# Altium schematic sheet HW.SchDoc
size A3; SheetNumber: 4; SheetTotal: 6
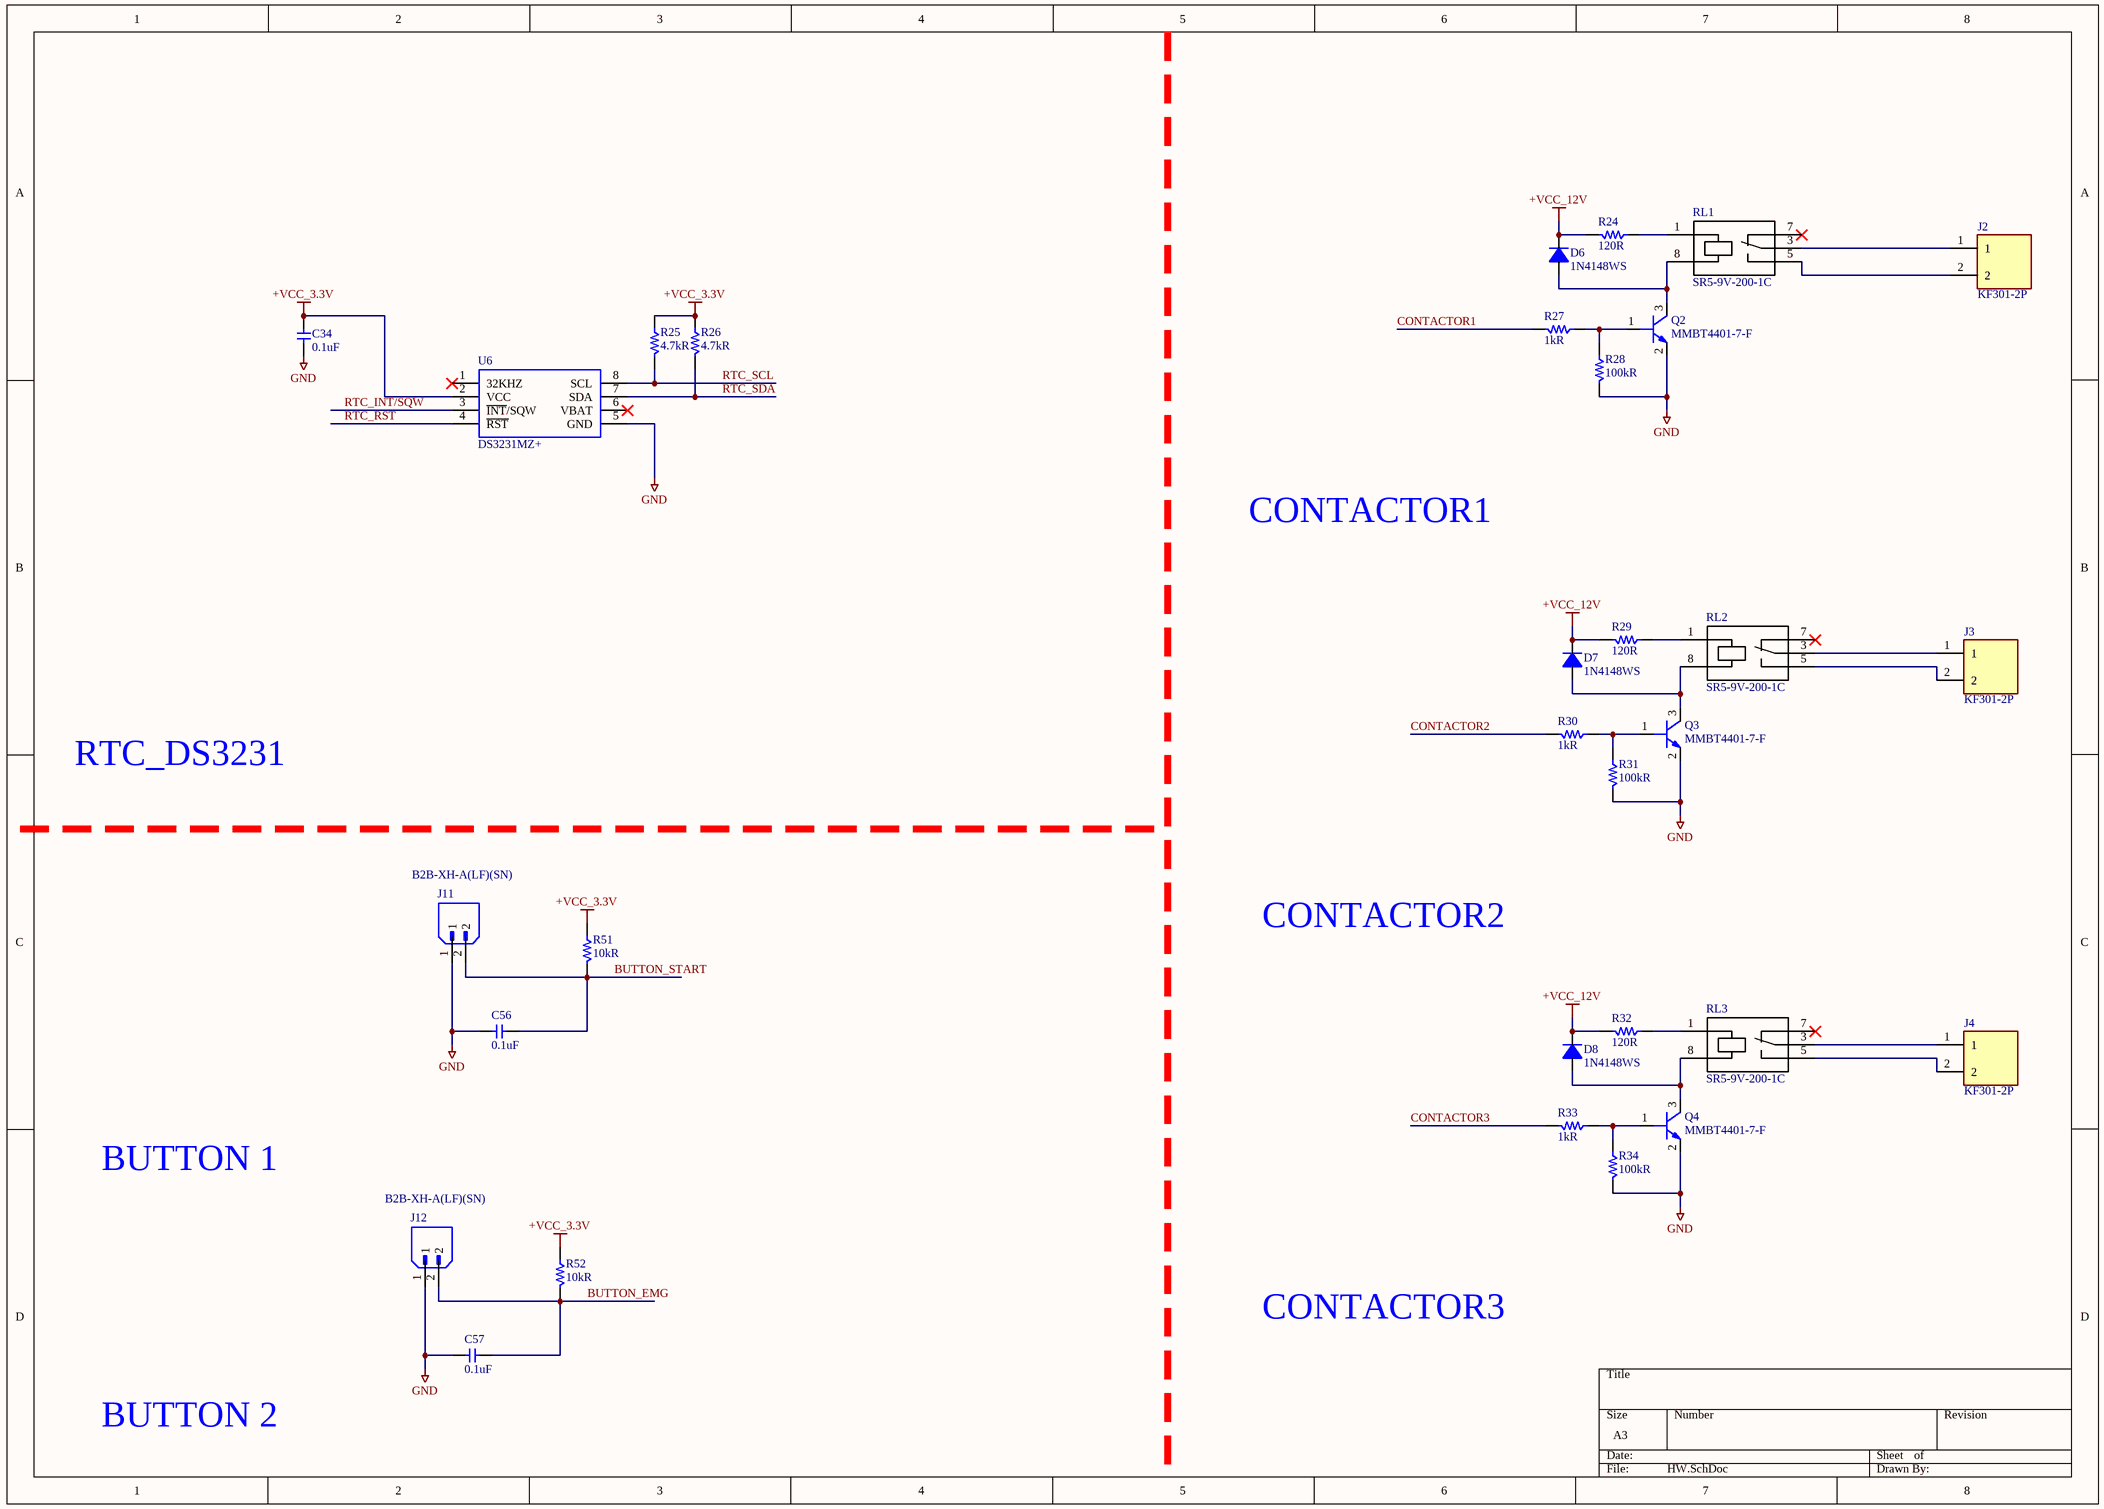
[diagram p0: HW.SchDoc]

## Parts
C34  0.1uF  [CAP 0402 (1005)]
C56  0.1uF  [CAP 0402 (1005)]
C57  0.1uF  [CAP 0402 (1005)]
D6  1N4148WS  [SOD323]
D7  1N4148WS  [SOD323]
D8  1N4148WS  [SOD323]
J2  KF301-2P  [HANDSON_KF301-2P]
J3  KF301-2P  [HANDSON_KF301-2P]
J4  KF301-2P  [HANDSON_KF301-2P]
J11  B2B-XH-A(LF)(SN)  [JST_B2B-XH-A(LF)(SN)]
J12  B2B-XH-A(LF)(SN)  [JST_B2B-XH-A(LF)(SN)]
Q2  MMBT4401-7-F  [SOT-23-3]
Q3  MMBT4401-7-F  [SOT-23-3]
Q4  MMBT4401-7-F  [SOT-23-3]
R24  120R  [RES 0603 (1608)]
R25  4.7kR  [RES 0402 (1005)]
R26  4.7kR  [RES 0402 (1005)]
R27  1kR  [RES 0402 (1005)]
R28  100kR  [RES 0402 (1005)]
R29  120R  [RES 0603 (1608)]
R30  1kR  [RES 0402 (1005)]
R31  100kR  [RES 0402 (1005)]
R32  120R  [RES 0603 (1608)]
R33  1kR  [RES 0402 (1005)]
R34  100kR  [RES 0402 (1005)]
R51  10kR  [RES 0402 (1005)]
R52  10kR  [RES 0402 (1005)]
RL1  SR5-9V-200-1C  [RELAY SR5-9V-200-1C]
RL2  SR5-9V-200-1C  [RELAY SR5-9V-200-1C]
RL3  SR5-9V-200-1C  [RELAY SR5-9V-200-1C]
U6  DS3231MZ+  [SOIC127P600X175-8N]

## Nets
+VCC_3.3V: C34.1 R25.2 R26.2 R51.2 R52.2 U6.2(VCC)
+VCC_12V: D6.1(K) D7.1(K) D8.1(K) R24.1 R29.1 R32.1
GND: C34.2 C56.2 C57.2 J11.1 J12.1 Q2.2(E) Q3.2(E) Q4.2(E) R28.1 R31.1 R34.1 U6.5(GND)
BUTTON_EMG: C57.1 J12.2 R52.1
BUTTON_START: C56.1 J11.2 R51.1
CONTACTOR1: R27.1
CONTACTOR2: R30.1
CONTACTOR3: R33.1
RTC_INT/SQW: U6.3(~{INT}/SQW)
RTC_RST: U6.4(~{RST})
RTC_SCL: R25.1 U6.8(SCL)
RTC_SDA: R26.1 U6.7(SDA)
NetD6_2: D6.2(A) Q2.3(C) RL1.8(C2)
NetD7_2: D7.2(A) Q3.3(C) RL2.8(C2)
NetD8_2: D8.2(A) Q4.3(C) RL3.8(C2)
NetJ2_1: J2.1 RL1.3(C)
NetJ2_2: J2.2 RL1.5(NO)
NetJ3_1: J3.1 RL2.3(C)
NetJ3_2: J3.2 RL2.5(NO)
NetJ4_1: J4.1 RL3.3(C)
NetJ4_2: J4.2 RL3.5(NO)
NetQ2_1: Q2.1(B) R27.2 R28.2
NetQ3_1: Q3.1(B) R30.2 R31.2
NetQ4_1: Q4.1(B) R33.2 R34.2
NetR24_2: R24.2 RL1.1(C1)
NetR29_2: R29.2 RL2.1(C1)
NetR32_2: R32.2 RL3.1(C1)

Not connected (* = marked no-connect by the designer): RL1 7(NC)*; RL2 7(NC)*; RL3 7(NC)*; U6 1(32KHZ)* 6(VBAT)*

## Notes on the sheet
- CONTACTOR1
- RTC_DS3231
- CONTACTOR2
- BUTTON 1
- CONTACTOR3
- BUTTON 2

## Library data of the parts
C34 C56 C57 = CAP0402 0.1uF 50V: 50V 100nF ±10% 0402 Multilayer Ceramic Capacitors MLCC - SMD/SMT ROHS; Manufacturer: Samwha Capacitor; Manufacturer Part Number: CS1005X7R104K500NR; Supplier: LCSC electronics; Unit Price: $0.0017
D6-D8 = DIO 1N4148WS: DIODE GEN PURP 75V 150MA SOD323F; Manufacturer: Fairchild/ON Semiconductor; Diode Type: Standard; Voltage - Forward (Vf) (Max) @ If: 1V @ 10mA; Speed: Small Signal =< 200mA (Io), Any Speed; Current - Reverse Leakage @ Vr: 5µA @ 75V; Capacitance @ Vr, F: 4pF @ 0V, 1MHz; Supplier 1: Digi-Key; Manufacturer Part Number: 1N4148WS; RoHS: RoHS Compliant; Category: Discrete Semiconductor Products; Stock 1: 318953; Pricing 1: 1=0.18, 10=0.168, 100=0.0912, 500=0.05614, 1000=0.03827 (USD); Packaging: Cut Tape (CT); Part Status: Active; Current - Average Rectified (Io): 150mA; Mounting Type: Surface Mount; Package / Case: SC-90, SOD-323F; Supplier Device Package: SOD-323F; Operating Temperature - Junction: 150°C (Max); ComponentLink1URL: https://www.fairchildsemi.com/datasheets/1N/1N4148WS.pdf; ComponentLink1Description: https://www.fairchildsemi.com/datasheets/1N/1N4148WS.pdf; Supplier Part Number 1: 1N4148WSFSCT-ND
J2-J4 = KF301-2P: 2 Pin Terminal Block 5mm Pitch; MF: Handson Technology; SnapEDA_Link: https://www.snapeda.com/parts/KF301-2P/Handson+Technology/view-part/?ref=snap; Package: None; Value: *; MP: KF301-2P; Check_prices: https://www.snapeda.com/parts/KF301-2P/Handson+Technology/view-part/?ref=eda
J11 J12 = B2B-XH-A(LF)(SN): Connector Header Through Hole 2 position 0.098 (2.50mm); MF: JST Sales; SnapEDA_Link: https://www.snapeda.com/parts/B2B-XH-A(LF)(SN)/JST/view-part/?ref=snap; Package: None; Value: *; MP: B2B-XH-A(LF)(SN); Check_prices: https://www.snapeda.com/parts/B2B-XH-A(LF)(SN)/JST/view-part/?ref=eda
Q2-Q4 = TRANS MMBT4401-7-F: TRANS NPN 40V 0.6A SMD SOT23-3; Manufacturer: Diodes Incorporated; Vce Saturation (Max) @ Ib, Ic: 750mV @ 50mA, 500mA; DC Current Gain (hFE) (Min) @ Ic, Vce: 100 @ 150mA, 1V; Frequency - Transition: 250MHz; Supplier 1: Digi-Key; Manufacturer Part Number: MMBT4401-7-F; RoHS: RoHS Compliant; Category: Discrete Semiconductor Products; Stock 1: 86548; Pricing 1: 1=0.15, 10=0.134, 100=0.0729, 500=0.04486, 1000=0.03059 (USD); Packaging: Cut Tape (CT); Part Status: Active; Transistor Type: NPN; Current - Collector Cutoff (Max): -; Operating Temperature: -55°C ~ 150°C (TJ); Mounting Type: Surface Mount; Package / Case: TO-236-3, SC-59, SOT-23-3; Supplier Device Package: SOT-23-3; ComponentLink1URL: https://www.diodes.com/assets/Datasheets/ds30039.pdf; ComponentLink1Description: https://www.diodes.com/assets/Datasheets/ds30039.pdf; Supplier Part Number 1: MMBT4401-FDICT-ND
R24 R29 R32 = RES0603 120R 1%: ±1% 120Ω 0603 Chip Resistor - Surface Mount ROHS; Manufacturer: VO; Manufacturer Part Number: SCR0603F120R; Supplier: LCSC electronics; Unit Price: $0.0009
R25 R26 = RES0402 4.7kR 1%: ±1% 4.7kΩ 0402 Chip Resistor - Surface Mount ROHS; Manufacturer: VO; Manufacturer Part Number: SCR0402F4K7; Supplier: LCSC electronics; Unit Price: $0.0005
R27 R30 R33 = RES0402 1kR 1%: ±5% 1kΩ 0402 Chip Resistor - Surface Mount ROHS; Manufacturer: VO; Manufacturer Part Number: SCR0402J1K; Supplier: LCSC electronics; Unit Price: $0.0004
R28 R31 R34 = RES0402 100kR 1%: ±1% 100kΩ 0402 Chip Resistor - Surface Mount ROHS; Manufacturer: VO; Manufacturer Part Number: SCR0402F100K; Supplier: LCSC electronics; Unit Price: $0.0005
R51 R52 = RES0402 10kR 1%: ±1% 10kΩ 0402 Chip Resistor - Surface Mount ROHS; Manufacturer: VO; Manufacturer Part Number: SCR0402F10K; Supplier: LCSC electronics; Unit Price: $0.0005
RL1-RL3 = RELAY 1 FORM C SR5-9V-200-1C: 15.6 X 10.6 X 11.8 MM, 9 V, 1 A,; Manufacturer: CUI Devices; Supplier 1: Digi-Key; Manufacturer Part Number: SR5-9V-200-1C; Stock 1: 985; Pricing 1: 1=1.3, 10=1.218, 25=1.0824, 50=1.0282, 100=0.9742, 250=0.8659, 450=0.8118, 950=0.7577, 9800=0.7198 (USD); Supplier Part Number 1: 2223-SR5-9V-200-1C-ND
U6 = IC DS3231MZ+: I2C SOP-8 Real-time Clocks (RTC) ROHS; Manufacturer: Analog Devices Inc./Maxim Integrated; Manufacturer Part Number: DS3231MZ+TRL; Supplier: LCSD electronics; Unit Price: $1.9887